# Altium schematic sheet ESP8266.SchDoc: ESP8266-12F
size A4; CompanyName: github.com/aKaReZa75; Revision: 1.0; SheetNumber: 1; SheetTotal: 1; Project_Name: Design Template
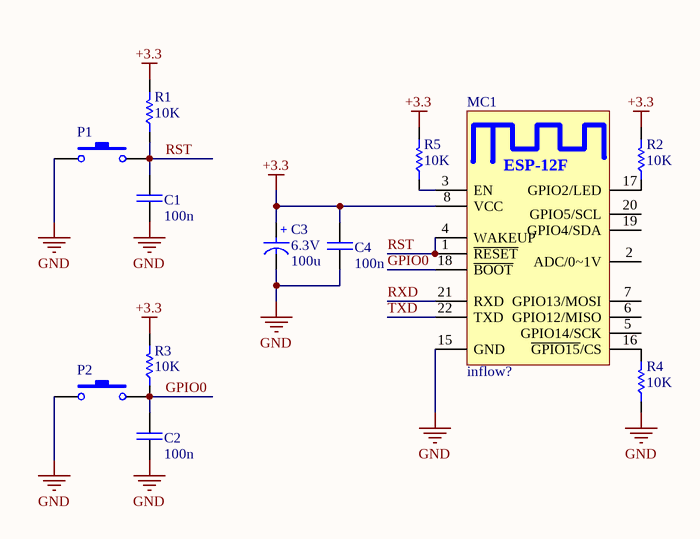
[diagram p0: ESP8266.SchDoc]

## Parts
C1  100n  [CAP 0805/2012]
C2  100n  [CAP 0805/2012]
C3  Rating: 6.3V  [cap 03]  (hidden comment: 100u)
C4  100n  [CAP 0805/2012]
MC1  Inflow: inflow?  [ESP8266_12F]  (hidden comment: ESP8266-12F)
P1  Value?  [JST XH B2B-XH-A]  (value not drawn)
P2  Value?  [JST XH B2B-XH-A]  (value not drawn)
R1  10K  [RES 0805 (2012X06L)]
R2  10K  [RES 0805 (2012X06L)]
R3  10K  [RES 0805 (2012X06L)]
R4  10K  [RES 0805 (2012X06L)]
R5  10K  [RES 0805 (2012X06L)]

## Nets
+3.3: C3.1(+) C4.1 MC1.8(VCC) R1.2 R2.2 R3.2 R5.2
GND: C1.2 C2.2 C3.2(-) C4.2 MC1.15(GND) P1.1 P2.1 R4.1
GPIO0: C2.1 MC1.18(~{BOOT}) P2.2 R3.1
RST: C1.1 MC1.1(~{RESET}) MC1.4(WAKEUP) P1.2 R1.1
RXD: MC1.21(RXD)
TXD: MC1.22(TXD)
NetMC1_3: MC1.3(EN) R5.1
NetMC1_16: MC1.16(~{GPIO15}/CS) R4.2
NetMC1_17: MC1.17(GPIO2/LED) R2.1

Not connected (* = marked no-connect by the designer): MC1 2(ADC/0~1V) 5(GPIO14/SCK) 6(GPIO12/MISO) 7(GPIO13/MOSI) 19(GPIO4/SDA) 20(GPIO5/SCL)

## Notes on the sheet
- Title:
- Project:
- Drawn by:
- Revision:
- Hossein Bagheri
- Company:
- Sheet
- of
- (in symbol ModSen_Com_ESP-12F) ESP-12F

## Library data of the parts
C1 C2 C4 = Cap_Multi_SMD_100nF_0805: Bipolar ceramic capacitor SMD; Inflow: inflow?; Type: MultiLayer; Rating: 50V; Validation: Valid; Package: 0805; Value: 100n
C3 = Cap_Electrolit: Electrolit Capacitor; Inflow: inflow?; Validation: Valid; Package: Dip; Type: Electrolit; Value: 100u
MC1 = ModSen_Com_ESP-12F: ESP8266 WIFI Module Model ESP-12F; Rating: 12F; Validation: NT; Package: SMD; Type: ESP8266; Value: ESP8266-12F
P1 P2 = Con_PushButtom: PushBottom Connector 2'Pin; Rating: Rating?; Validation: Valid; Inflow: inflow?; Value: Value?; Type: PushButtom; Package: Dip
R1-R5 = Res_SMD_0805: Resistor; Inflow: inflow?; Rating: 0.125W; Validation: Valid; Package: 0805; Type: 10%; Value: 10K